# EAGLE design stepper_x2 (EAGLE 7.5.0)
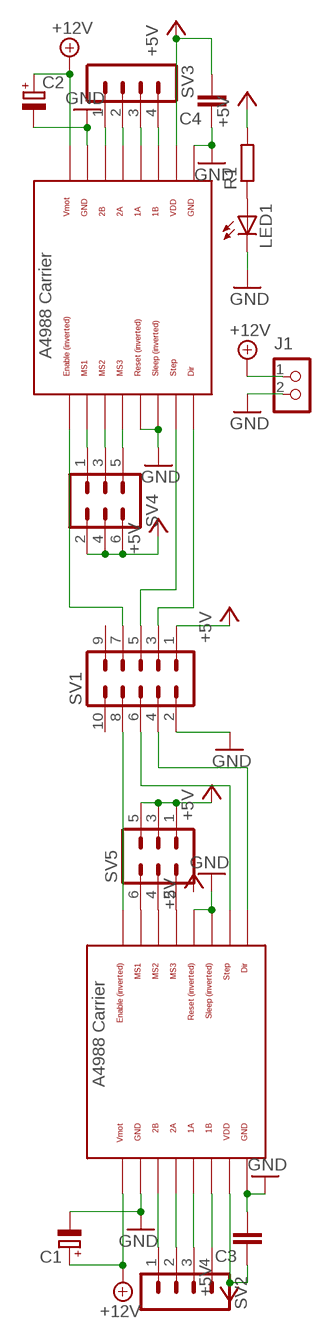
[diagram p0: schematic, sheet 1]

## Parts
C1  CPOL-EU153CLV-0605  [153CLV-0605]
C2  CPOL-EU153CLV-0605  [153CLV-0605]
C3  C-EU025-030X050  [C025-030X050]
C4  C-EU025-030X050  [C025-030X050]
J1  CON_TERMINAL_BLOCK_02-5MM  [TERMINAL_BLOCK_2P_5]
LED1  LED5MM  [LED5MM]
R1  R-EU_0411/12  [0411/12]
SV1  MA05-2  [MA05-2]
SV2  MA04-1  [MA04-1]
SV3  MA04-1  [MA04-1]
SV4  MA03-2  [MA03-2]
SV5  MA03-2  [MA03-2]
U$1  POLOLU_A4983CARRIER  [A4988BREAKOUT]
U$2  POLOLU_A4983CARRIER  [A4988BREAKOUT]

## Nets
+5V: C3.1 C4.2 R1.2 SV1.1 SV4.2 SV4.4 SV4.6 SV5.1 SV5.3 SV5.5 U$1.VDD U$2.VDD
+12V: C1.+ C2.+ J1.1 U$1.VMOT U$2.VMOT
GND: C1.- C2.- C3.2 C4.1 J1.2 LED1.K(C) SV1.2 U$1.GND U$1.GND@0(GND) U$1.RST U$1.SLP(SLEEP) U$2.GND U$2.GND@0(GND) U$2.RST U$2.SLP(SLEEP)
N$1: LED1.A R1.1
N$2: SV1.7 U$1.EN
N$3: SV1.3 U$1.DIR
N$4: SV1.5 U$1.STEP
N$5: SV2.4 U$2.1B
N$6: SV2.3 U$2.1A
N$7: SV2.2 U$2.2A
N$8: SV2.1 U$2.2B
N$9: SV3.4 U$1.1B
N$10: SV3.3 U$1.1A
N$11: SV3.2 U$1.2A
N$12: SV1.8 U$2.EN
N$13: SV1.4 U$2.DIR
N$14: SV1.6 U$2.STEP
N$15: SV3.1 U$1.2B
N$16: SV4.5 U$1.MS3
N$17: SV4.3 U$1.MS2
N$18: SV4.1 U$1.MS1
N$19: SV5.2 U$2.MS3
N$20: SV5.4 U$2.MS2
N$21: SV5.6 U$2.MS1
Unconnected: SV1.9 SV1.10

## Library data of the parts
C1 C2 = resistor:CPOL-EU: POLARIZED CAPACITOR, European symbol
C3 C4 = resistor:C-EU: CAPACITOR, European symbol
J1 = dp_devices:CON_TERMINAL_BLOCK_02: 2 poles wire to board terminal block
LED1 = RepRapjr:LED: LED OSRAM: - CHIPLED LG R971, LG N971, LY N971, LG Q971, LY Q971, LO R971, LY R971 LH N974, LH R974 LS Q976, LO Q976, LY Q976 LO Q996 - Hyper CHIPLED LW Q18S LB Q993, LB Q99A, LB R99A - SideLED LS A670, LO A670, LY A670, LG A670, LP A670 LB A673, LV A673, LT A673, LW A673 LH A674 LY A675 LS A676, LA A676, LO A676, LY A676, LW A676 LS A679, LY A679, LG A679 - Hyper Micro SIDELED® LS Y876, LA Y876, LO Y876, LY Y876 LT Y87S - SmartLED LW L88C, LW L88S LB L89C, LB L89S, LG L890 LS L89K, LO L89K, LY L89K LS L896, LA L896, LO L896, LY L896 - TOPLED LS T670, LO T670, LY T670, LG T670, LP T670 LSG T670, LSP T670, LSY T670, LOP T670, LYG T670 LG T671, LOG T671, LSG T671 LB T673, LV T673, LT T673, LW T673 LH T674 LS T676, LA T676, LO T676, LY T676, LB T676, LH T676, LSB T676, LW T676 LB T67C, LV T67C, LT T67C, LS T67K, LO T67K, LY T67K, LW E67C LS E67B, LA E67B, LO E67B, LY E67B, LB E67C, LV E67C, LT E67C LW T67C LS T679, LY T679, LG T679 LS T770, LO T770, LY T770, LG T770, LP T770 LB T773, LV T773, LT T773, LW T773 LH T774 LS E675, LA E675, LY E675, LS T675 LS T776, LA T776, LO T776, LY T776, LB T776 LHGB T686 LT T68C, LB T68C - Hyper Mini TOPLED® LB M676 - Mini TOPLED Santana® LG M470 LS M47K, LO M47K, LY M47K Source: http://www.osram.convergy.de LUXEON: - LUMILED® LXK2-PW12-R00, LXK2-PW12-S00, LXK2-PW14-U00, LXK2-PW14-V00 LXK2-PM12-R00, LXK2-PM12-S00, LXK2-PM14-U00 LXK2-PE12-Q00, LXK2-PE12-R00, LXK2-PE12-S00, LXK2-PE14-T00, LXK2-PE14-U00 LXK2-PB12-K00, LXK2-PB12-L00, LXK2-PB12-M00, LXK2-PB14-N00, LXK2-PB14-P00, LXK2-PB14-Q00 LXK2-PR12-L00, LXK2-PR12-M00, LXK2-PR14-Q00, LXK2-PR14-R00 LXK2-PD12-Q00, LXK2-PD12-R00, LXK2-PD12-S00 LXK2-PH12-R00, LXK2-PH12-S00 LXK2-PL12-P00, LXK2-PL12-Q00, LXK2-PL12-R00 Source: www.luxeon.com KINGBRIGHT: KA-3528ASYC Source: www.kingbright.com
R1 = resistor:R-EU_: RESISTOR, European symbol
SV1 = con-lstb:MA05-2: PIN HEADER; OC_FARNELL: unknown; OC_NEWARK: unknown
SV2 SV3 = con-lstb:MA04-1: PIN HEADER; OC_FARNELL: unknown; OC_NEWARK: unknown
SV4 SV5 = con-lstb:MA03-2: PIN HEADER; OC_FARNELL: unknown; OC_NEWARK: unknown
U$1 U$2 = RepRapjr:POLOLU_A4983CARRIER

## Board
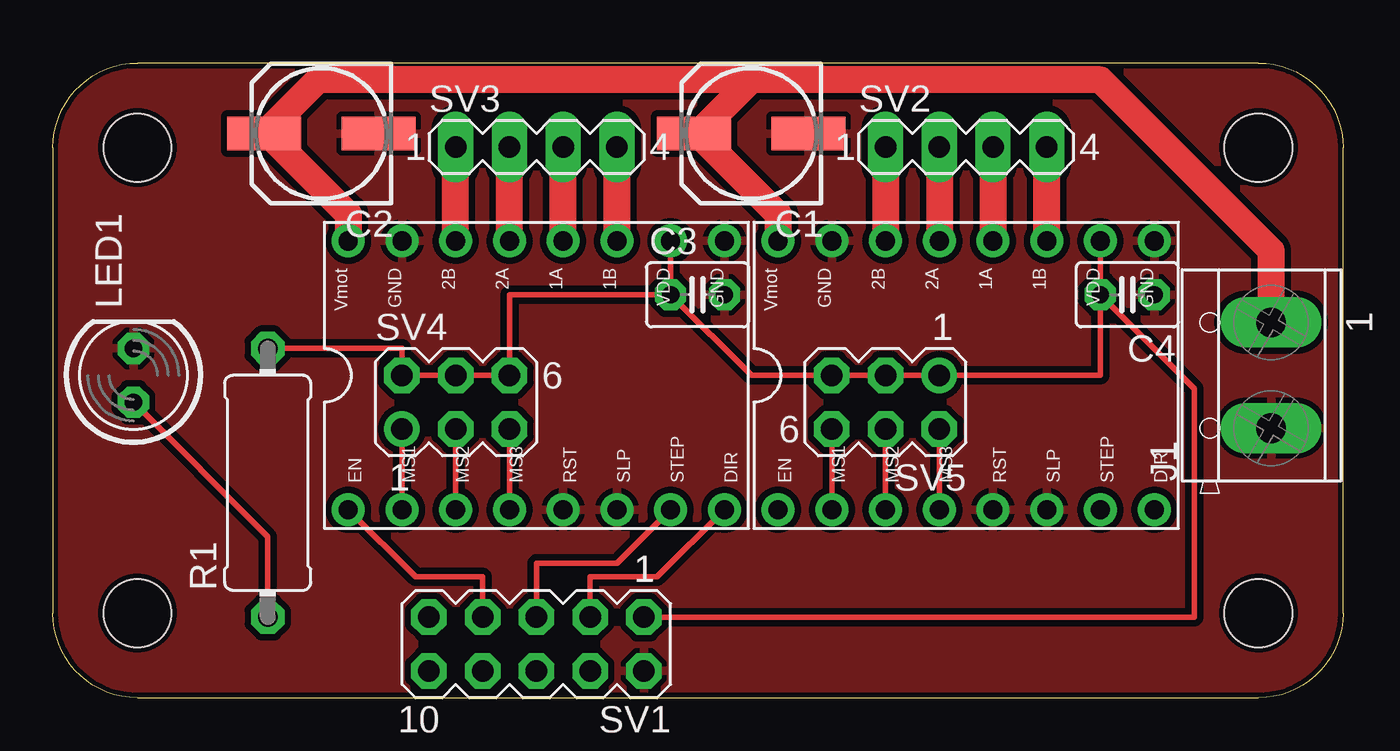
[diagram p1: board, top side]
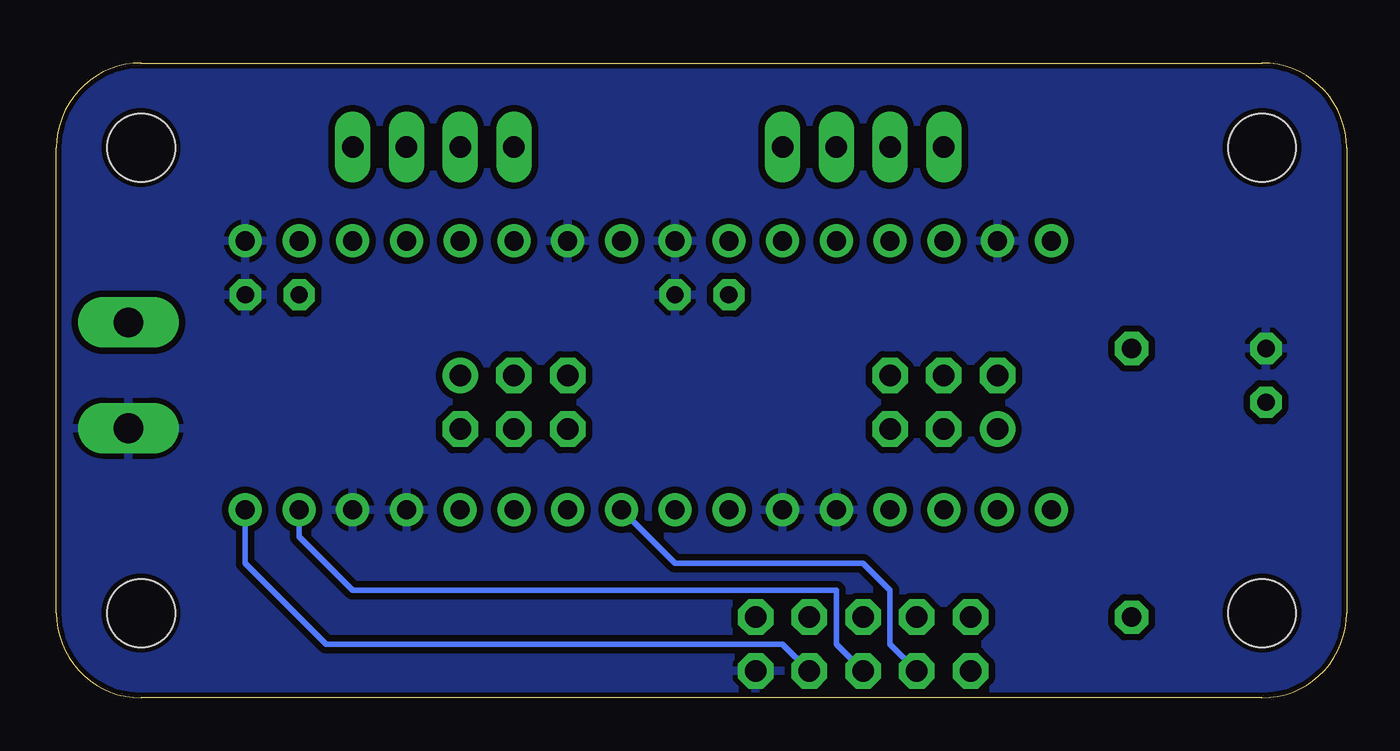
[diagram p2: board, bottom side, seen from below]

Size 61 x 30 mm. Coordinates in mm from the lower left corner, seen from the top.
Outline: 4,0 57,0 arc90 61,4 61,26 arc90 57,30 4,30 arc90 0,26 0,4 arc90 4,0
Copper layers (1*16): Top 0.035mm / dielectric 1.5mm / Bottom 0.035mm
Design rules "spectra_pcb *": minimum track width 10mil, minimum drill 24mil, track to track 12mil, track to pad 12mil, pad to pad 15mil, via to via 15mil, smd to smd 8mil, copper to edge 10mil, drill to drill 8mil, minimum pad ring 13mil, minimum via ring 13mil, stop-mask expansion 4mil, vias tented up to drill 0mil, thermal gap 10mil
Holes 3.2 mm at 4,4 57,4 4,26 57,26

### Footprints (pad centres in the part's own frame; a part is rotated, then mirrored left to right if it is on the bottom)
153CLV-0605 = smd 3.5 x 1.6: + 2.7,0; - -2.7,0
C025-030X050 = drill 0.813 octagon: 1 -1.27,0; 2 1.27,0
TERMINAL_BLOCK_2P_5 = drill 1.4 pad 2.38 long: 1 2.5,-0.45; 2 -2.5,-0.45
LED5MM = drill 0.813 octagon: A -1.27,0; K 1.27,0
0411/12 = drill 0.914 octagon: 1 -6.35,0; 2 6.35,0
MA05-2 = drill 1.016 octagon: 1 -5.08,-1.27; 2 -5.08,1.27; 3 -2.54,-1.27; 4 -2.54,1.27; 5 0,-1.27; 6 0,1.27; 7 2.54,-1.27; 8 2.54,1.27; 9 5.08,-1.27; 10 5.08,1.27
MA04-1 = drill 1.016 long: 1 -3.81,0; 2 -1.27,0; 3 1.27,0; 4 3.81,0
MA03-2 = drill 1.016: 1 -2.54,-1.27 | drill 1.016 octagon: 2 -2.54,1.27; 3 0,-1.27; 4 0,1.27; 5 2.54,-1.27; 6 2.54,1.27
A4988BREAKOUT = drill 0.9: 1A 8.89,1.27; 1B 11.43,1.27; 2A 6.35,1.27; 2B 3.81,1.27; DIR 16.51,-11.43; EN -1.27,-11.43; GND 16.51,1.27; GND@0 1.27,1.27; MS1 1.27,-11.43; MS2 3.81,-11.43; MS3 6.35,-11.43; RST 8.89,-11.43; SLP 11.43,-11.43; STEP 13.97,-11.43; VDD 13.97,1.27; VMOT -1.27,1.27

### Placement (x,y rotation side)
C1  33.02,26.67 180 top
C2  12.7,26.67 180 top
C3  30.48,19.05 0 top
C4  50.8,19.05 180 top
J1  57.15,15.24 90 top
LED1  3.81,15.24 90 top
R1  10.16,10.16 90 top
SV1  22.86,2.54 180 top
SV2  43.18,26.04 0 top
SV3  22.86,26.04 0 top
SV4  19.05,13.97 0 top
SV5  39.37,13.97 180 top
U$1  15.24,20.32 0 top
U$2  35.56,20.32 0 top

### Tracks (layer width: path | path; a pad name or v marks a point on that pad's centre or on a via)
+5V
  Top 0.254: U$1.VDD C3.1 | R1.2 16.51,16.51 SV4.2 SV4.4 SV4.6 21.59,19.05 C3.1 | U$2.VDD C4.2 | SV1.1 53.98,3.81 53.98,14.61 C4.2 | C4.2 49.53,15.24 SV5.1 SV5.3 SV5.5 33.02,15.24 C3.1
+12V
  Top 1.27: J1.1 57.6,21.14 49.53,29.21 33.02,29.21 | 33.02,29.21 12.54,29.21 C2.+ 10.16,26.67 13.97,22.86 U$1.VMOT | C1.+ 30.48,26.67 | 30.48,26.67 33.02,29.21 | 30.48,26.67 34.29,22.86 U$2.VMOT
GND
  pour Top: 0,30.48 60.96,30.48 60.96,0 0,0
  pour Bottom: 0,30.48 60.96,30.48 60.96,0 0,0
N$1
  Top 0.254: LED1.A 10.16,7.62 R1.1
N$2
  Top 0.254: U$1.EN 17.14,5.71 20.32,5.71 SV1.7
N$3
  Top 0.254: U$1.DIR 28.57,5.71 25.4,5.71 SV1.3
N$4
  Top 0.254: U$1.STEP 26.67,6.35 22.86,6.35 SV1.5
N$5
  Top 1.27: U$2.1B SV2.4
N$6
  Top 1.27: SV2.3 U$2.1A
N$7
  Top 1.27: SV2.2 U$2.2A
N$8
  Top 1.27: SV2.1 U$2.2B
N$9
  Top 1.27: U$1.1B SV3.4
N$10
  Top 1.27: U$1.1A SV3.3
N$11
  Top 1.27: U$1.2A SV3.2
N$12
  Bottom 0.254: SV1.8 21.59,2.54 21.59,5.08 22.86,6.35 31.75,6.35 U$2.EN
N$13
  Bottom 0.254: SV1.4 26.67,2.54 48.26,2.54 52.07,6.35 U$2.DIR
N$14
  Bottom 0.254: SV1.6 24.13,2.54 24.13,5.08 46.99,5.08 49.53,7.62 U$2.STEP
N$15
  Top 1.27: U$1.2B SV3.1
N$16
  Top 0.254: SV4.5 U$1.MS3
N$17
  Top 0.254: SV4.3 U$1.MS2
N$18
  Top 0.254: SV4.1 U$1.MS1
N$19
  Top 0.254: SV5.2 U$2.MS3
N$20
  Top 0.254: SV5.4 U$2.MS2
N$21
  Top 0.254: SV5.6 U$2.MS1